# EAGLE schematic Shield (EAGLE 6.5.0)
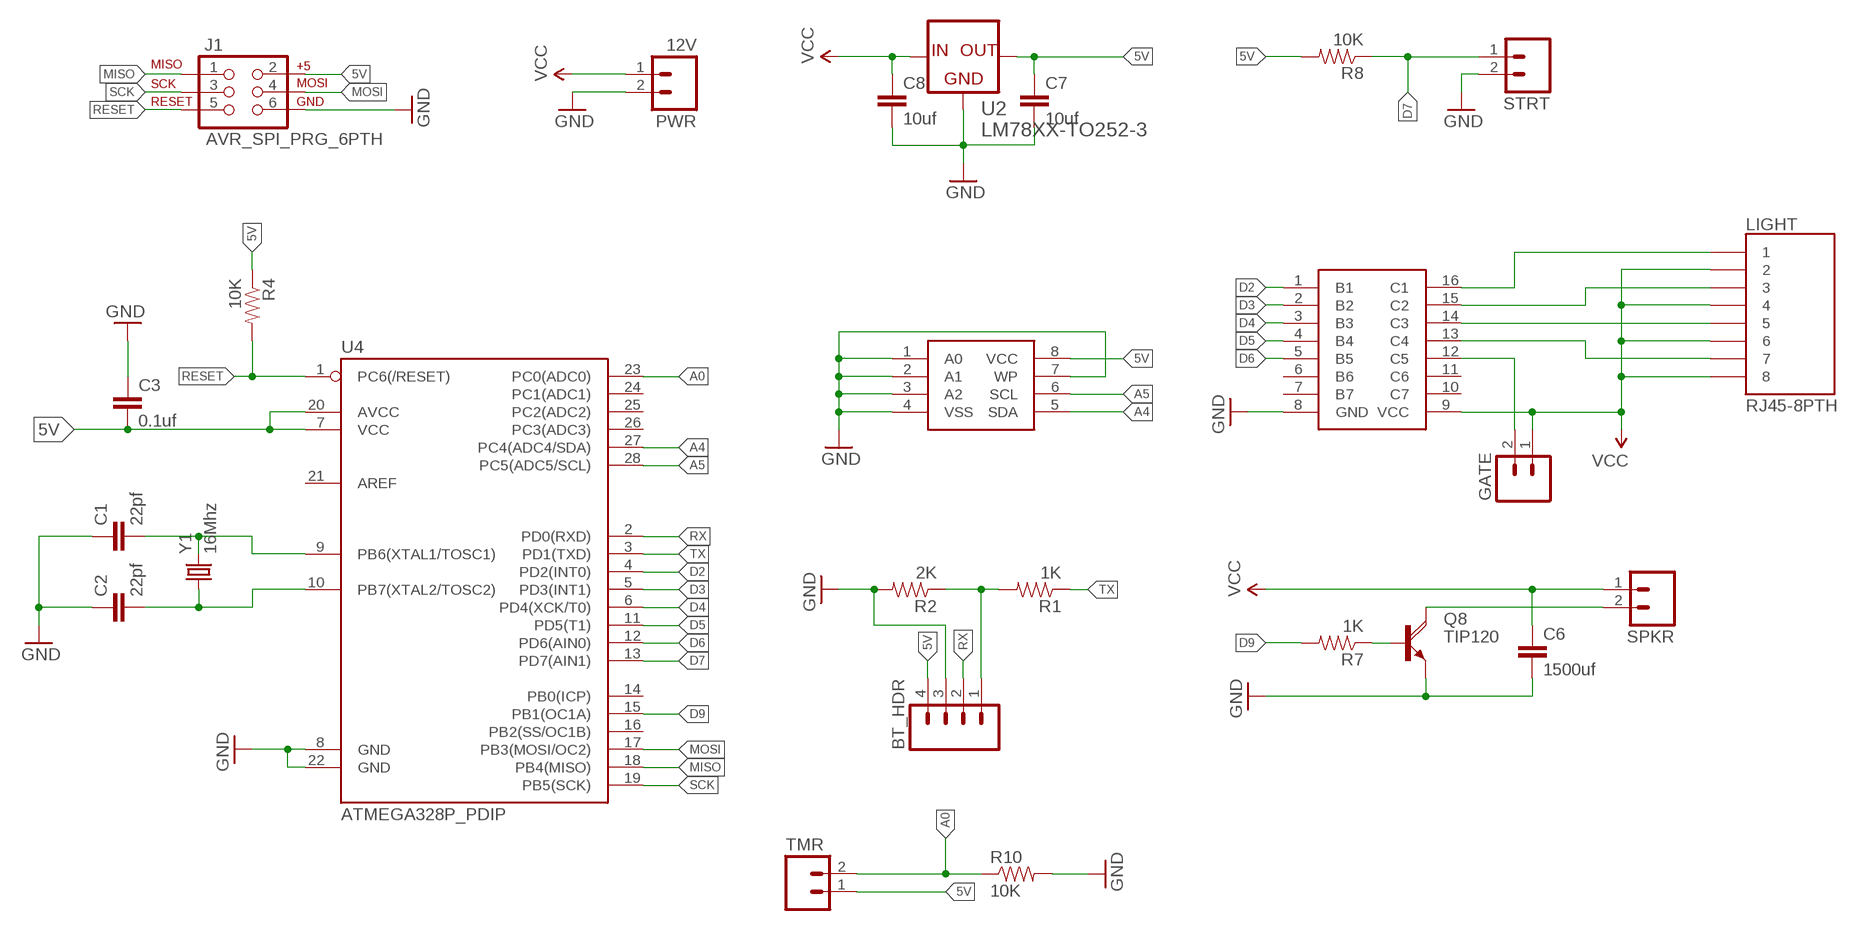
[diagram p0: schematic, sheet 1]

## Parts
BT_HDR  M04PTH  [1X04]
C1  22pf  CAP1206  [1206]
C2  22pf  CAP1206  [1206]
C3  0.1uf  CAP1206  [1206]
C6  1500uf  CAPPTH1  [CAP-PTH-5MM]
C7  10uf  CAPPTH  [CAP-PTH-SMALL]
C8  10uf  CAPPTH  [CAP-PTH-SMALL]
GATE  M023.5MM  [SCREWTERMINAL-3.5MM-2]
J1  AVR_SPI_PRG_6PTH  [2X3]
LIGHT  RJ45-8PTH  [RJ45-8]
PWR  12V  M023.5MM  [SCREWTERMINAL-3.5MM-2]
Q8  TIP120  [TO220V]
R1  1K  RESISTOR1206  [1206]
R2  2K  RESISTOR1206  [1206]
R4  10K  RESISTOR1206  [1206]
R7  1K  RESISTOR1206  [1206]
R8  10K  RESISTOR1206  [1206]
R10  10K  RESISTOR1206  [1206]
SPKR  M023.5MM  [SCREWTERMINAL-3.5MM-2]
STRT  M023.5MM  [SCREWTERMINAL-3.5MM-2]
TMR  M023.5MM  [SCREWTERMINAL-3.5MM-2]
U2  LM78XX-TO252-3  [TO252-3]
U4  ATMEGA328P_PDIP  [DIL28-3]
U$1  MC1413D  [SO016]
U$2  24AAXXX  [SOIC-8-EIAJ]
Y1  16Mhz  CRYSTALHC49US  [HC49US]

## Nets
5V: BT_HDR.4 C3.2 C7.1 J1.2 R4.1 R8.2 TMR.1 U2.3(OUT) U4.7(VCC) U4.20(AVCC) U$2.8(VCC)
A0: R10.1 TMR.2 U4.23(PC0(ADC0))
A4: U4.27(PC4(ADC4/SDA)) U$2.5(SDA)
A5: U4.28(PC5(ADC5/SCL)) U$2.6(SCL)
D2: U4.4(PD2(INT0)) U$1.1(B1)
D3: U4.5(PD3(INT1)) U$1.2(B2)
D4: U4.6(PD4(XCK/T0)) U$1.3(B3)
D5: U4.11(PD5(T1)) U$1.4(B4)
D6: U4.12(PD6(AIN0)) U$1.5(B5)
D7: R8.1 STRT.1 U4.13(PD7(AIN1))
D9: R7.2 U4.15(PB1(OC1A))
GATE: GATE.2 U$1.12(C5)
GND: BT_HDR.3 C1.1 C2.1 C3.1 C6.2 C7.2 C8.2 J1.6 PWR.2 Q8.3(E) R2.2 R10.2 STRT.2 U2.2(COM) U4.8(GND) U4.22(GND) U$1.8(GND) U$2.1(A0) U$2.2(A1) U$2.3(A2) U$2.4(VSS) U$2.7(WP)
MISO: J1.1 U4.18(PB4(MISO))
MOSI: J1.4 U4.17(PB3(MOSI/OC2))
N$1: BT_HDR.1 R1.2 R2.1
N$2: LIGHT.1 U$1.16(C1)
N$3: LIGHT.3 U$1.15(C2)
N$4: LIGHT.5 U$1.14(C3)
N$5: LIGHT.7 U$1.13(C4)
N$12: Q8.2(C) SPKR.2
N$15: C1.2 U4.9(PB6(XTAL1/TOSC1)) Y1.2
N$19: Q8.1(B) R7.1
N$24: C2.2 U4.10(PB7(XTAL2/TOSC2)) Y1.1
RESET: J1.5 R4.2 U4.1(PC6(/RESET))
RX: BT_HDR.2 U4.2(PD0(RXD))
SCK: J1.3 U4.19(PB5(SCK))
TX: R1.1 U4.3(PD1(TXD))
VCC: C6.1 C8.1 GATE.1 LIGHT.2 LIGHT.4 LIGHT.6 LIGHT.8 PWR.1 SPKR.1 U2.1(IN) U$1.9(VCC)
Unconnected: U4.14(PB0(ICP)) U4.16(PB2(SS/OC1B)) U4.21(AREF) U4.24(PC1(ADC1)) U4.25(PC2(ADC2)) U4.26(PC3(ADC3)) U$1.6(B6) U$1.7(B7) U$1.10(C7) U$1.11(C6)

## Library data of the parts
BT_HDR = SparkFun-Connectors:M04: Header 4 Standard 4-pin 0.1" header. Use with straight break away headers (SKU : PRT-00116), right angle break away headers (PRT-00553), swiss pins (PRT-00743), machine pins (PRT-00117), and female headers (PRT-00115). Molex polarized connector foot print use with SKU : PRT-08231 with associated crimp pins and housings. 1MM SMD Version SKU: PRT-10208
C1-C3 C6-C8 = SparkFun-Capacitors:CAP: Capacitor Standard 0603 ceramic capacitor, and 0.1" leaded capacitor.
GATE PWR SPKR STRT TMR = SparkFun-Connectors:M02: Header 2 Standard 2-pin 0.1" header. Use with straight break away headers (SKU : PRT-00116), right angle break away headers (PRT-00553), swiss pins (PRT-00743), machine pins (PRT-00117), and female headers (PRT-00115). Molex polarized connector foot print use with SKU : PRT-08233 with associated crimp pins and housings.
J1 = SparkFun-Connectors:AVR_SPI_PRG_6: AVR ISP 6 Pin This is the reduced ISP connector for AVR programming. Common on Arduino. This footprint will take up less PCB space and can be used with a 10-pin to 6-pin adapter such as SKU: BOB-08508 **Special note about "TEST_POINT" package. The stop mask is on the top side, so if you want your programming test points to be on the bottom of your board, make sure to place this package on the bottom side of the board. This also ensure that the orientation to program from the bottom side will be correct.
LIGHT = SparkFun-Connectors:RJ45-8: RJ45 Jack Simple RJ45, 8-pin connection - connector for common Cat5, Cat5e, and Cat6 Ethernet cables. Footprint not yet proven in production. Connector sku is PRT-00643; Breakout PCB sku is BOB-00716.
Q8 = ucigate:TIP120: NPN DARLINGTON TRANSISTOR
R1 R2 R4 R7 R8 R10 = SparkFun-Passives:RESISTOR: Resistor Basic schematic elements and footprints for 0603, 1206, and PTH resistors.
U2 = element14-com:LM78XX-TO252-3: IC, POSITIVE-VOLTAGE REGULATORS, 3.3V, 3-TO-252; MPN: UA78M33CKVURG3; OC_FARNELL: 2075446; OC_NEWARK: 80K3502; PACKAGE: 3-TO-252; SUPPLIER: TEXAS INSTRUMENTS
U4 = SparkFun-DigitalIC:ATMEGA328P_PDIP: uC used in the Arduino 32kb flash, 1k EEPROM, 2k SRAM This is the through-hole version of this chip.
U$1 = ucigate:MC1413D
U$2 = ucigate:24AAXXX
Y1 = SparkFun-FreqCtrl:CRYSTAL: Various standard crystals. Proven footprints. Spark Fun Electronics SKU : COM-00534

## Net classes
0 default: width 0.381 mm